# EAGLE design PEC11D dual rotary enc test (EAGLE 9.6.2)
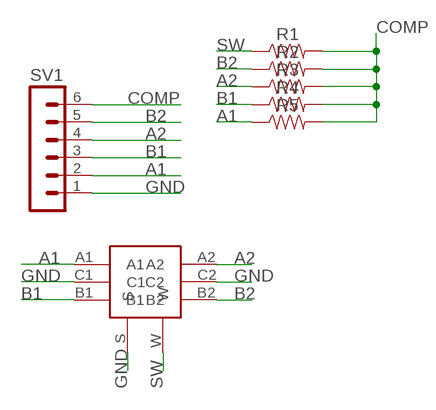
[diagram p0: schematic, sheet 1]

## Parts
R1  RESISTOR21206  [1206]
R2  RESISTOR21206  [1206]
R3  RESISTOR21206  [1206]
R4  RESISTOR21206  [1206]
R5  RESISTOR21206  [1206]
SV1  MA06-1  [MA06-1]
U$1  PEC11DPEC11D  [PEC11D_TH]

## Nets
A1: R5.1 SV1.2 U$1.A1
A2: R3.1 SV1.4 U$1.A2
B1: R4.1 SV1.3 U$1.B1
B2: R2.1 SV1.5 U$1.B2
COMP: R1.2 R2.2 R3.2 R4.2 R5.2 SV1.6
GND: SV1.1 U$1.C1 U$1.C2 U$1.S
SW: R1.1 U$1.W

## Library data of the parts
R1-R5 = 00jim:RESISTOR2: Generic Resistor Package
SV1 = con-lstb:MA06-1: PIN HEADER; OC_FARNELL: unknown; OC_NEWARK: unknown
U$1 = 01jim:PEC11D

## Board
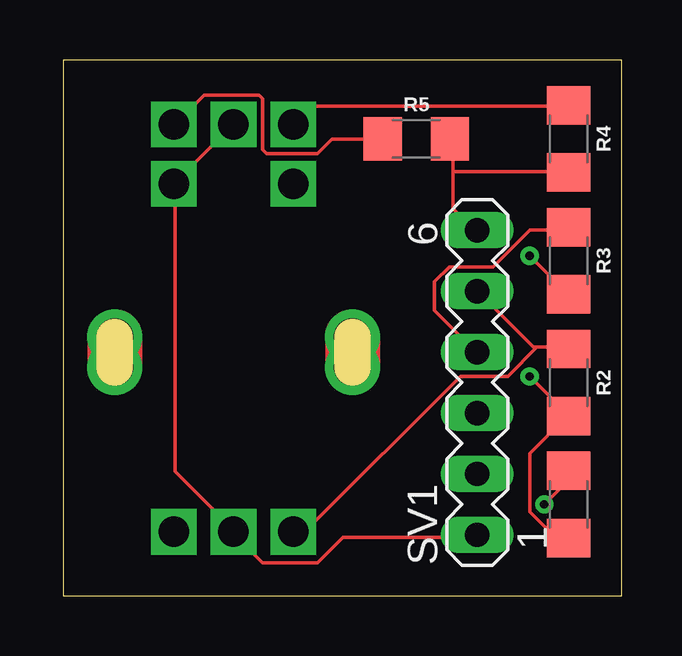
[diagram p1: board, top side]
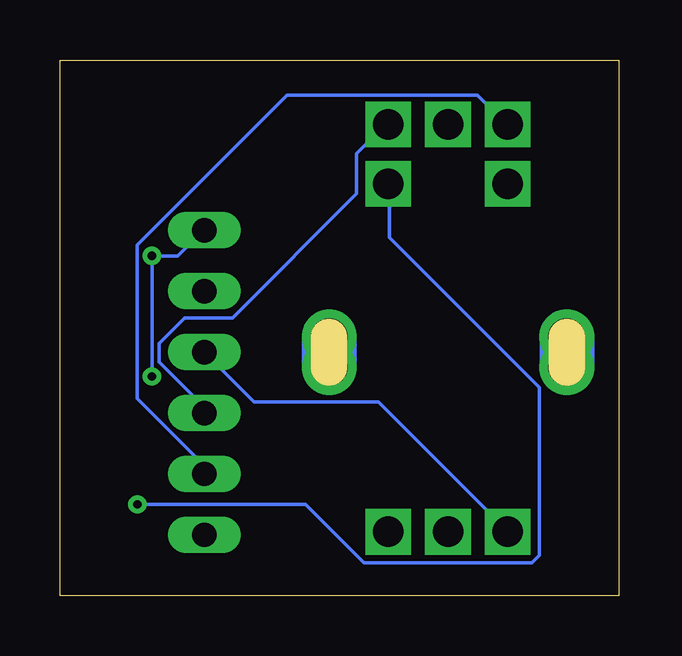
[diagram p2: board, bottom side, seen from below]

Size 23.29 x 22.34 mm. Coordinates in mm from the lower left corner, seen from the top.
Outline: 0,0 23.29,0 23.29,22.34 0,22.34 0,0
Copper layers (1*16): Top 0.035mm / dielectric 1.5mm / Bottom 0.035mm
Design rules "default": minimum track width 6mil, minimum drill 0.35mm, track to track 6mil, track to pad 6mil, pad to pad 6mil, via to via 6mil, smd to smd 6mil, copper to edge 40mil, drill to drill 6mil, minimum pad ring 10mil, minimum via ring 8mil, stop-mask expansion 4mil, vias tented up to drill 0mil, thermal gap 10mil

### Footprints (pad centres in the part's own frame; a part is rotated, then mirrored left to right if it is on the bottom)
1206 = smd 1.6 x 1.8: 1 -1.4,0; 2 1.4,0
MA06-1 = drill 1.016 long: 1 -6.35,0; 2 -3.81,0; 3 -1.27,0; 4 1.27,0; 5 3.81,0; 6 6.35,0
PEC11D_TH = drill 1.27 pad 1.524 square: A1 -2.489,9.5; A2 -2.489,-7.493; B1 2.489,9.5; B2 2.489,-7.493; C1 0,9.5; C2 0,-7.493; S -2.489,7.01; W 2.489,7.01 | drill 1.524: P$9 -4.953,0.635; P$10 -4.953,-0.635; P$11 4.953,0.635; P$12 4.953,-0.635

### Placement (x,y rotation side)
R1  21.08,3.81 270 top
R2  21.08,8.89 270 top
R3  21.08,13.97 270 top
R4  21.08,19.05 270 top
R5  14.73,19.05 0 top
SV1  17.27,8.89 90 top
U$1  7.11,10.16 0 top

### Tracks (layer width: path | path; a pad name or v marks a point on that pad's centre or on a via)
A1
  Top 0.152: R5.1 11.23,19.05 10.62,18.44 8.48,18.44 8.33,18.59 8.33,20.73 8.18,20.88 5.89,20.88 4.67,19.66 U$1.A1
  Bottom 0.152: SV1.2 17.32,5.18 17.32,5.49 20.07,8.23 20.07,14.63 13.82,20.88 5.89,20.88 4.67,19.66 U$1.A1
A2
  Top 0.152: R3.1 20.98,15.24 19.46,15.24 17.93,13.72 16.1,13.72 15.49,13.11 15.49,11.89 17.17,10.21 SV1.4
  Bottom 0.152: SV1.4 15.19,8.08 10.01,8.08 4.67,2.74 U$1.A2
B1
  Top 0.152: R4.1 20.98,20.42 10.46,20.42 9.7,19.66 U$1.B1
  Bottom 0.152: SV1.3 17.32,7.62 17.32,7.92 19.15,9.75 19.15,10.52 18.09,11.58 16.1,11.58 10.92,16.76 10.92,18.44 9.7,19.66 U$1.B1
B2
  Top 0.152: 19.76,10.36 19.61,10.36 SV1.5 | 19.76,10.36 20.98,10.36 R2.1 | 19.76,10.36 18.54,9.14 16.56,9.14 10.16,2.74 9.7,2.74 U$1.B2
COMP  (via drill 0.35)
  Top 0.152: R1.2 20.98,2.44 20.52,2.44 19.46,3.5 19.46,5.94 20.98,7.47 R2.2 20.98,7.62 v19.46,9.14 | v19.46,14.17 20.98,12.65 R3.2 | 16.26,17.68 16.26,16.15 17.17,15.24 SV1.6 | 16.26,17.68 16.26,19.05 R5.2 | 16.26,17.68 20.98,17.68 R4.2
  Bottom 0.152: SV1.6 17.32,15.24 18.39,14.17 v19.46,14.17 v19.46,9.14
GND
  Top 0.152: U$1.C1 U$1.S 4.67,17.07 4.67,5.18 7.11,2.74 U$1.C2 7.11,2.59 8.33,1.37 10.62,1.37 11.68,2.44 17.17,2.44 SV1.1
SW  (via drill 0.35)
  Top 0.152: v20.07,3.81 20.98,4.72 20.98,5.18 R1.1
  Bottom 0.152: v20.07,3.81 13.06,3.81 10.62,1.37 3.61,1.37 3.3,1.68 3.3,8.69 9.55,14.94 9.55,17.07 U$1.W